# EAGLE schematic mLRS-tx-dual-base-v031-np (EAGLE 7.5.0)
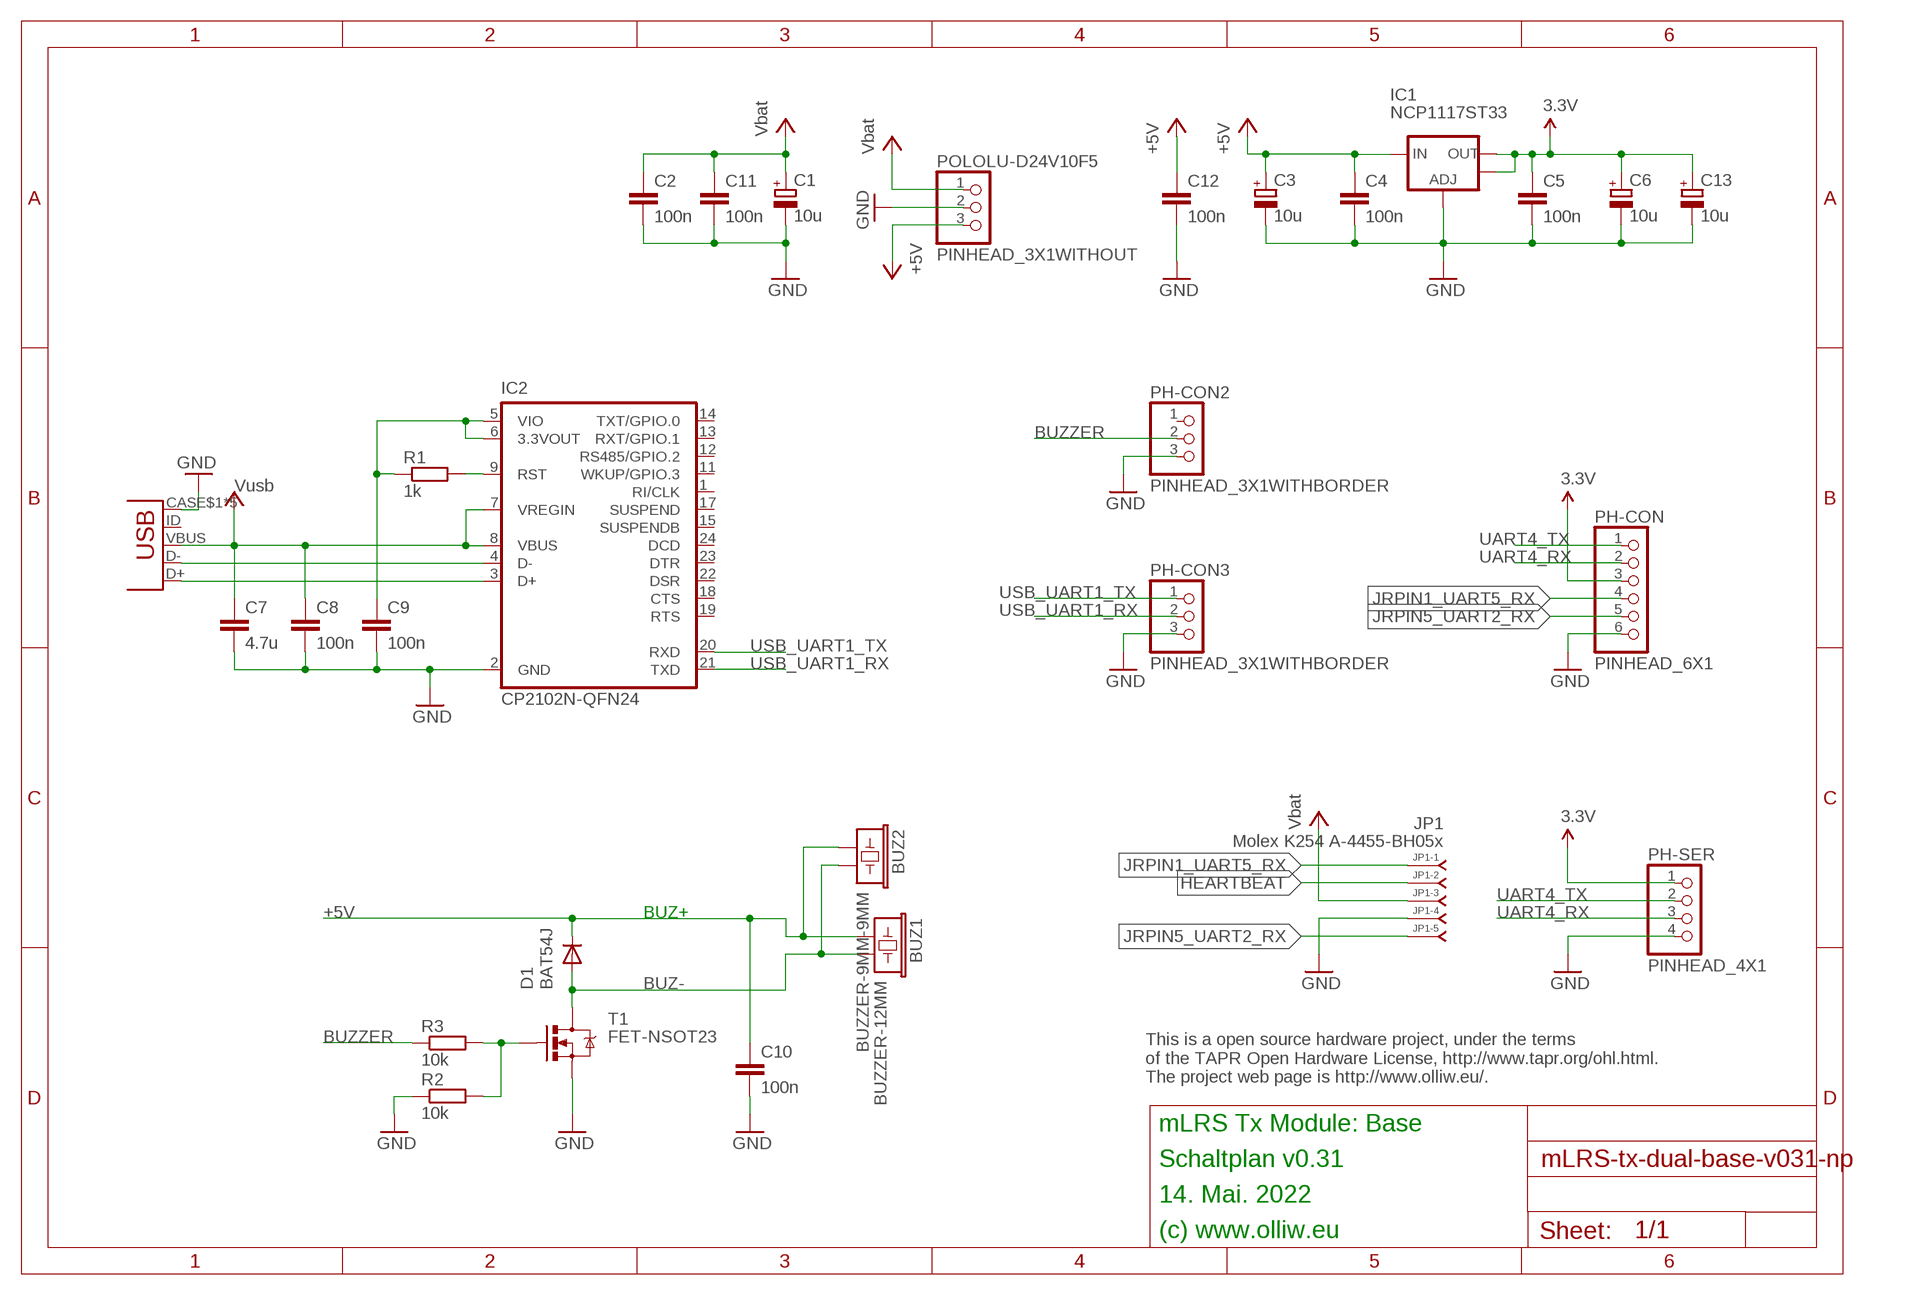
[diagram p0: schematic, sheet 1]

## Parts
BUZ1  BUZZER-12MM  [BUZZER-12MM]
BUZ2  BUZZER-9MM-9MM  [BUZZER-9MM]
C1  10u  CPOL-EUSMCA  [SMC_A]
C2  100n  C-EUC0603  [C0603]
C3  10u  CPOL-EUSMCA  [SMC_A]
C4  100n  C-EUC0603  [C0603]
C5  100n  C-EUC0603  [C0603]
C6  10u  CPOL-EUSMCA  [SMC_A]
C7  4.7u  C-EUC0603  [C0603]
C8  100n  C-EUC0402  [C0402]
C9  100n  C-EUC0402  [C0402]
C10  100n  C-EUC0402  [C0402]
C11  100n  C-EUC0603  [C0603]
C12  100n  C-EUC0603  [C0603]
C13  10u  CPOL-EUSMCA  [SMC_A]
D1  BAT54J  DIODE-SOD110-R  [SOD110-R]
IC1  NCP1117ST33  V_REG_LM1117SOT223  [SOT223]
IC2  CP2102N-QFN24  [QFN24-CP2102N]
JP1  Molex K254 A-4455-BH05x  4455-B05_S  [4455-B05]
PH-CON  PINHEAD_6X1  [PINHEAD_6X1]
PH-CON2  PINHEAD_3X1WITHBORDER  [PINHEAD_3X1]
PH-CON3  PINHEAD_3X1WITHBORDER  [PINHEAD_3X1]
PH-SER  PINHEAD_4X1  [PINHEAD_4X1]
POLOLU-D24V10F5  PINHEAD_3X1WITHOUT  [PINHEAD_3X1_WO]
R1  1k  R-EU_R0402  [R0402]
R2  10k  R-EU_R0402  [R0402]
R3  10k  R-EU_R0402  [R0402]
T1  FET-NSOT23  [SOT23]
U$1  USB-MICROB-UP-NONPLATED  [USB-MICROB-UP-NONPLATED]

## Nets
3.3V: C5.1 C6.+ C13.+ IC1.2(OUT) IC1.4(OUT) PH-CON.3 PH-SER.1
3.3V-CP2102: C9.1 IC2.5(VIO) IC2.6(3.3VOUT) R1.1
+5V: BUZ1.+ BUZ2.+ C3.+ C4.1 C10.1 C12.1 D1.C IC1.3(IN) POLOLU-D24V10F5.3
BUZ-: BUZ1.- BUZ2.- D1.A T1.3(D)
BUZZER: PH-CON2.2 R3.1
GND: C1.- C2.2 C3.- C4.2 C5.2 C6.- C7.2 C8.2 C9.2 C10.2 C11.2 C12.2 C13.- IC1.1(ADJ) IC2.2(GND) JP1.4 PH-CON2.3 PH-CON3.3 PH-CON.6 PH-SER.4 POLOLU-D24V10F5.2 R2.1 T1.2(S) U$1.CASE$1(GND) U$1.CASE$2(GND) U$1.CASE$3(GND) U$1.CASE$4(GND) U$1.GND
HEARTBEAT: JP1.2
JRPIN1_UART5_RX: JP1.1 PH-CON.4
JRPIN5_UART2_RX: JP1.5 PH-CON.5
N$1: IC2.4(D-) U$1.D-
N$2: R2.2 R3.2 T1.1(G)
N$3: IC2.3(D+) U$1.D+
N$21: IC2.9(RST) R1.2
UART4_RX: PH-CON.2 PH-SER.3
UART4_TX: PH-CON.1 PH-SER.2
USB_UART1_RX: IC2.21(TXD) PH-CON3.2
USB_UART1_TX: IC2.20(RXD) PH-CON3.1
VCC: C1.+ C2.1 C11.1 JP1.3 POLOLU-D24V10F5.1 ; supply symbol labelled Vbat
VUSB: C7.1 C8.1 IC2.7(VREGIN) IC2.8(VBUS) U$1.VBUS ; supply symbol labelled Vusb
Unconnected: IC2.1(RI/CLK) IC2.11(WKUP/GPIO.3) IC2.12(RS485/GPIO.2) IC2.13(RXT/GPIO.1) IC2.14(TXT/GPIO.0) IC2.15(SUSPENDB) IC2.17(SUSPEND) IC2.18(CTS) IC2.19(RTS) IC2.22(DSR) IC2.23(DTR) IC2.24(DCD) PH-CON2.1 U$1.ID

## Notes on the sheet
- BUZ+
- This is a open source hardware project, under the terms
  of the TAPR Open Hardware License, http://www.tapr.org/ohl.html.
  The project web page is http://www.olliw.eu/.
- mLRS Tx Module: Base
- Schaltplan v0.31
- 14. Mai. 2022
- (c) www.olliw.eu

## Library data of the parts
BUZ1 BUZ2 = # stdlib:BUZZER
C1 C3 C6 C13 = rcl:CPOL-EU: POLARIZED CAPACITOR, European symbol
C2 C4 C5 C7-C12 = rcl:C-EU: CAPACITOR, European symbol
D1 = diode:DIODE-: DIODE
IC1 = # SparkFun2:V_REG_LM1117: Voltage Regulator LM1117 Standard adjustable voltage regulator but in SMD form. Spark Fun Electronics SKU : COM-00595
IC2 = # stdlib:CP2102N-QFN24
JP1 = con-molex-kk:4455-B05_S: RECEPTACAL
PH-CON = # stdlib:PINHEAD_6X1
PH-CON2 PH-CON3 POLOLU-D24V10F5 = # stdlib:PINHEAD_3X1
PH-SER = # stdlib:PINHEAD_4X1
R1-R3 = rcl:R-EU_: RESISTOR, European symbol
T1 = # stdlib:FET-N
U$1 = # stdlib:USB-MICROB